# Altium schematic sheet power-systems-v3.SchDoc
size 297 x 209 mm
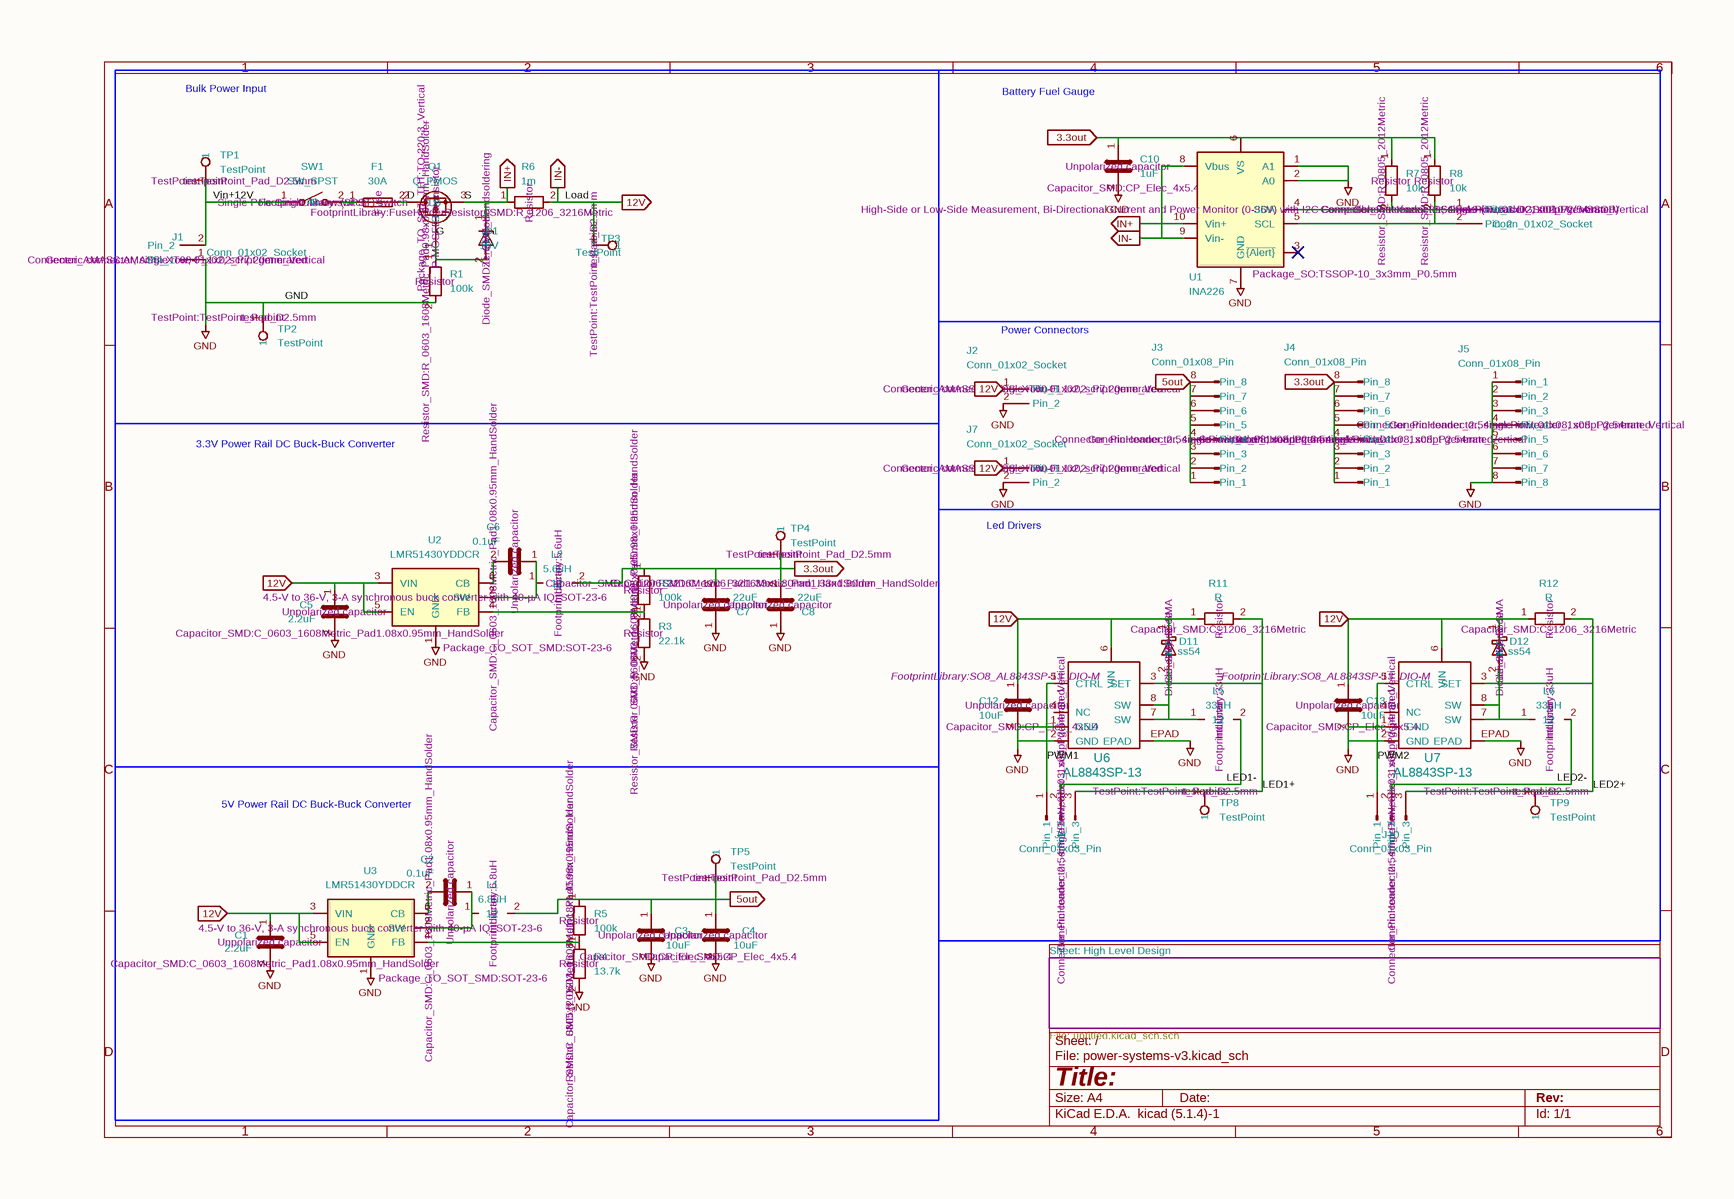
[diagram p0: power-systems-v3.SchDoc]

## Parts
C1  Description: Unpolarized capacitor  Footprint: Capacitor_SMD:C_0603_1608Metric_Pad1.08x0.95mm_HandSolder  [C_0603_1608Metric_Pad1.08x0.95mm_HandSolder]  (hidden comment: 2.2uF)
C2  Description: Unpolarized capacitor  Footprint: Capacitor_SMD:C_0603_1608Metric_Pad1.08x0.95mm_HandSolder  [C_0603_1608Metric_Pad1.08x0.95mm_HandSolder]  (hidden comment: 0.1uF)
C3  Description: Unpolarized capacitor  Footprint: Capacitor_SMD:CP_Elec_4x5.4  [CP_Elec_4x5.4]  (hidden comment: 10uF)
C4  Description: Unpolarized capacitor  Footprint: Capacitor_SMD:CP_Elec_4x5.4  [CP_Elec_4x5.4]  (hidden comment: 10uF)
C5  Description: Unpolarized capacitor  Footprint: Capacitor_SMD:C_0603_1608Metric_Pad1.08x0.95mm_HandSolder  [C_0603_1608Metric_Pad1.08x0.95mm_HandSolder]  (hidden comment: 2.2uF)
C6  Description: Unpolarized capacitor  Footprint: Capacitor_SMD:C_0603_1608Metric_Pad1.08x0.95mm_HandSolder  [C_0603_1608Metric_Pad1.08x0.95mm_HandSolder]  (hidden comment: 0.1uF)
C7  Description: Unpolarized capacitor  Footprint: Capacitor_SMD:C_1206_3216Metric_Pad1.33x1.80mm_HandSolder  [C_1206_3216Metric_Pad1.33x1.80mm_HandSolder]  (hidden comment: 22uF)
C8  Description: Unpolarized capacitor  Footprint: Capacitor_SMD:C_1206_3216Metric_Pad1.33x1.80mm_HandSolder  [C_1206_3216Metric_Pad1.33x1.80mm_HandSolder]  (hidden comment: 22uF)
C10  Description: Unpolarized capacitor  Footprint: Capacitor_SMD:CP_Elec_4x5.4  [CP_Elec_4x5.4]  (hidden comment: 1uF)
C12  Description: Unpolarized capacitor  Footprint: Capacitor_SMD:CP_Elec_4x5.4  [CP_Elec_4x5.4]  (hidden comment: 10uF)
C13  Description: Unpolarized capacitor  Footprint: Capacitor_SMD:CP_Elec_4x5.4  [CP_Elec_4x5.4]  (hidden comment: 10uF)
D1  Description: Zener diode  Footprint: Diode_SMD:D_SMB_Handsoldering  [D_SMB_Handsoldering]  (hidden comment: 10V)
D11  Description: Schottky diode  Footprint: Diode_SMD:D_SMA  [D_SMA]  (hidden comment: ss54)
D12  Description: Schottky diode  Footprint: Diode_SMD:D_SMA  [D_SMA]  (hidden comment: ss54)
F1  Footprint: FootprintLibrary:FuseHolder  [FuseHolder]  (hidden comment: 30A)
J1  Description: Generic connector, single row, 01x02, script generated  Footprint: Connector_AMASS:AMASS_XT60-F_1x02_P7.20mm_Vertical  [AMASS_XT60-F_1x02_P7.20mm_Vertical]  (hidden comment: Conn_01x02_Socket)
J2  Description: Generic connector, single row, 01x02, script generated  Footprint: Connector_AMASS:AMASS_XT60-F_1x02_P7.20mm_Vertical  [AMASS_XT60-F_1x02_P7.20mm_Vertical]  (hidden comment: Conn_01x02_Socket)
J3  Description: Generic connector, single row, 01x08, script generated  Footprint: Connector_PinHeader_2.54mm:PinHeader_1x08_P2.54mm_Vertical  [PinHeader_1x08_P2.54mm_Vertical]  (hidden comment: Conn_01x08_Pin)
J4  Description: Generic connector, single row, 01x08, script generated  Footprint: Connector_PinHeader_2.54mm:PinHeader_1x08_P2.54mm_Vertical  [PinHeader_1x08_P2.54mm_Vertical]  (hidden comment: Conn_01x08_Pin)
J5  Description: Generic connector, single row, 01x08, script generated  Footprint: Connector_PinHeader_2.54mm:PinHeader_1x08_P2.54mm_Vertical  [PinHeader_1x08_P2.54mm_Vertical]  (hidden comment: Conn_01x08_Pin)
J6  Description: Generic connector, single row, 01x02, script generated  Footprint: Connector_PinHeader_2.54mm:PinHeader_1x02_P2.54mm_Vertical  [PinHeader_1x02_P2.54mm_Vertical]  (hidden comment: Conn_01x02_Socket)
J7  Description: Generic connector, single row, 01x02, script generated  Footprint: Connector_AMASS:AMASS_XT60-F_1x02_P7.20mm_Vertical  [AMASS_XT60-F_1x02_P7.20mm_Vertical]  (hidden comment: Conn_01x02_Socket)
J9  Description: Generic connector, single row, 01x03, script generated  Footprint: Connector_PinHeader_2.54mm:PinHeader_1x03_P2.54mm_Vertical  [PinHeader_1x03_P2.54mm_Vertical]  (hidden comment: Conn_01x03_Pin)
J10  Description: Generic connector, single row, 01x03, script generated  Footprint: Connector_PinHeader_2.54mm:PinHeader_1x03_P2.54mm_Vertical  [PinHeader_1x03_P2.54mm_Vertical]  (hidden comment: Conn_01x03_Pin)
L1  Description: Inductor  Footprint: FootprintLibrary:6.8uH  [6.8uH]  (hidden comment: 6.8uH)
L2  Description: Inductor  Footprint: FootprintLibrary:5.6uH  [5.6uH]  (hidden comment: 5.6uH)
L5  Description: Inductor  Footprint: FootprintLibrary:33uH  [33uH]  (hidden comment: 33uH)
L6  Description: Inductor  Footprint: FootprintLibrary:33uH  [33uH]  (hidden comment: 33uH)
Q1  Description: P-MOSFET transistor  Footprint: Package_TO_SOT_THT:TO-220-3_Vertical  [TO-220-3_Vertical]  (hidden comment: Q_PMOS)
R1  Description: Resistor  Footprint: Resistor_SMD:R_0603_1608Metric_Pad0.98x0.95mm_HandSolder  [R_0603_1608Metric_Pad0.98x0.95mm_HandSolder]  (hidden comment: 100k)
R2  Description: Resistor  Footprint: Resistor_SMD:R_0603_1608Metric_Pad0.98x0.95mm_HandSolder  [R_0603_1608Metric_Pad0.98x0.95mm_HandSolder]  (hidden comment: 100k)
R3  Description: Resistor  Footprint: Resistor_SMD:R_0603_1608Metric_Pad0.98x0.95mm_HandSolder  [R_0603_1608Metric_Pad0.98x0.95mm_HandSolder]  (hidden comment: 22.1k)
R4  Description: Resistor  Footprint: Capacitor_SMD:C_0805_2012Metric_Pad1.18x1.45mm_HandSolder  [C_0805_2012Metric_Pad1.18x1.45mm_HandSolder]  (hidden comment: 13.7k)
R5  Description: Resistor  Footprint: Resistor_SMD:R_0603_1608Metric_Pad0.98x0.95mm_HandSolder  [R_0603_1608Metric_Pad0.98x0.95mm_HandSolder]  (hidden comment: 100k)
R6  Description: Resistor  Footprint: Resistor_SMD:R_1206_3216Metric  [R_1206_3216Metric]  (hidden comment: 1m)
R7  Description: Resistor  Footprint: Resistor_SMD:R_0805_2012Metric  [R_0805_2012Metric]  (hidden comment: 10k)
R8  Description: Resistor  Footprint: Resistor_SMD:R_0805_2012Metric  [R_0805_2012Metric]  (hidden comment: 10k)
R11  Description: Resistor  Footprint: Capacitor_SMD:C_1206_3216Metric  [C_1206_3216Metric]  (hidden comment: R)
R12  Description: Resistor  Footprint: Capacitor_SMD:C_1206_3216Metric  [C_1206_3216Metric]  (hidden comment: R)
SW1  Description: Single Pole Single Throw (SPST) switch  Footprint: FootprintLibrary:switch  [switch]  (hidden comment: SW_SPST)
TP1  Description: test point  Footprint: TestPoint:TestPoint_Pad_D2.5mm  [TestPoint_Pad_D2.5mm]  (hidden comment: TestPoint)
TP2  Description: test point  Footprint: TestPoint:TestPoint_Pad_D2.5mm  [TestPoint_Pad_D2.5mm]  (hidden comment: TestPoint)
TP3  Description: test point  Footprint: TestPoint:TestPoint_Pad_D2.5mm  [TestPoint_Pad_D2.5mm]  (hidden comment: TestPoint)
TP4  Description: test point  Footprint: TestPoint:TestPoint_Pad_D2.5mm  [TestPoint_Pad_D2.5mm]  (hidden comment: TestPoint)
TP5  Description: test point  Footprint: TestPoint:TestPoint_Pad_D2.5mm  [TestPoint_Pad_D2.5mm]  (hidden comment: TestPoint)
TP8  Description: test point  Footprint: TestPoint:TestPoint_Pad_D2.5mm  [TestPoint_Pad_D2.5mm]  (hidden comment: TestPoint)
TP9  Description: test point  Footprint: TestPoint:TestPoint_Pad_D2.5mm  [TestPoint_Pad_D2.5mm]  (hidden comment: TestPoint)
U1  Description: High-Side or Low-Side Measurement, Bi-Directional Current and Power Monitor (0-36V) with I2C Compatible Interface, TSSOP-10 (Texas DGS0010A / VSSOP)  Footprint: Package_SO:TSSOP-10_3x3mm_P0.5mm  [TSSOP-10_3x3mm_P0.5mm]  (hidden comment: INA226)
U2  Description: 4.5-V to 36-V, 3-A synchronous buck converter with 40-µA IQ, SOT-23-6  Footprint: Package_TO_SOT_SMD:SOT-23-6  [SOT-23-6]  (hidden comment: LMR51430YDDCR)
U3  Description: 4.5-V to 36-V, 3-A synchronous buck converter with 40-µA IQ, SOT-23-6  Footprint: Package_TO_SOT_SMD:SOT-23-6  [SOT-23-6]  (hidden comment: LMR51430YDDCR)
U6  Footprint: FootprintLibrary:SO8_AL8843SP-13_DIO-M  [SO8_AL8843SP-13_DIO-M]  (hidden comment: AL8843SP-13)
U7  Footprint: FootprintLibrary:SO8_AL8843SP-13_DIO-M  [SO8_AL8843SP-13_DIO-M]  (hidden comment: AL8843SP-13)

## Blocks framed on the sheet
Bulk Power Input /: D1 F1 J1 Q1 R1 R6 SW1 TP1-TP3
Battery Fuel Gauge /: C10 J6 R7 R8 U1
Power Connectors: J2-J5 J7
3.3V Power Rail / DC Buck-Buck Converter: C5-C8 L2 R2 R3 TP4 U2
Led Drivers /: C12 C13 D11 D12 J9 J10 L5 L6 R11 R12 TP8 TP9 U6 U7
5V Power Rail / DC Buck-Buck Converter: C1-C4 L1 R4 R5 TP5 U3

## Sub-sheets
High Level Design = untitled.SchDoc: no entries

## Ports
3.3out (in), 3.3out (out), 5out (in), 5out (out), 12V (in), 12V (out), IN+ (out), IN- (out)

## Nets
GND: C1.2 C3.2 C4.2 C5.2 C7.1 C8.1 C10.2 C12.2 C13.2 J1.1(Pin_1) J2.2(Pin_2) J5.1(Pin_1) J5.2(Pin_2) J5.3(Pin_3) J5.4(Pin_4) J5.5(Pin_5) J5.6(Pin_6) J5.7(Pin_7) J5.8(Pin_8) J7.2(Pin_2) R1.2 R3.2 R4.2 TP2.1 U1.1(A1) U1.2(A0) U1.7(GND) U2.1(GND) U3.1(GND) U6.1(GND) U6.2(GND) U6.EPAD U7.1(GND) U7.2(GND) U7.EPAD
3.3out: C7.2 C8.2 C10.1 J4.1(Pin_1) J4.2(Pin_2) J4.3(Pin_3) J4.4(Pin_4) J4.5(Pin_5) J4.6(Pin_6) J4.7(Pin_7) J4.8(Pin_8) L2.2 R2.1 R7.1 R8.1 TP4.1 U1.6(VS) ; port 3.3out
5out: C3.1 C4.1 J3.1(Pin_1) J3.2(Pin_2) J3.3(Pin_3) J3.4(Pin_4) J3.5(Pin_5) J3.6(Pin_6) J3.7(Pin_7) J3.8(Pin_8) L1.2 R5.1 TP5.1 ; port 5out
D: F1.2 Q1.2(D)
LED1+: J9.3(Pin_3) R11.2 TP8.1 U6.3(SET)
LED1-: J9.2(Pin_2) L5.2
LED2+: J10.3(Pin_3) R12.2 TP9.1 U7.3(SET)
LED2-: J10.2(Pin_2) L6.2
Load: C1.1 C5.1 C12.1 C13.1 D11.1(K) D12.1(K) J2.1(Pin_1) J7.1(Pin_1) R6.2 R11.1 R12.1 TP3.1 U1.8(Vbus) U1.9(Vin-) U2.3(VIN) U2.5(EN) U3.3(VIN) U3.5(EN) U6.6(VIN) U7.6(VIN) ; port 12V, port IN-
PWM1: J9.1(Pin_1) U6.5(CTRL)
PWM2: J10.1(Pin_1) U7.5(CTRL)
S: D1.1(K) Q1.3(S) R6.1 U1.10(Vin+) ; port IN+
Vin+12V: J1.2(Pin_2) SW1.1(A) TP1.1
NetC2_1: C2.1 L1.1 U3.2(SW)
NetC2_2: C2.2 U3.6(CB)
NetC6_1: C6.1 L2.1 U2.2(SW)
NetC6_2: C6.2 U2.6(CB)
NetD1_2: D1.2(A) Q1.1(G) R1.1
NetD11_2: D11.2(A) L5.1 U6.7(SW) U6.8(SW)
NetD12_2: D12.2(A) L6.1 U7.7(SW) U7.8(SW)
NetF1_1: F1.1 SW1.2(B)
NetJ6_1: J6.1(Pin_1) R7.2 U1.4(SDA)
NetJ6_2: J6.2(Pin_2) R8.2 U1.5(SCL)
NetR2_2: R2.2 R3.1 U2.4(FB)
NetR4_1: R4.1 R5.2 U3.4(FB)

Not connected (* = marked no-connect by the designer): U1 3(~{{Alert}})*; U6 4(NC); U7 4(NC)

## Notes on the sheet
- Sheet: High Level Design
- File: untitled.kicad_sch.sch
- Labels drawn without touching a wire or pin: G
- 1
- 2
- 3
- 4
- 5
- 6
- A
- B
- C
- D
- Title:
- File: power-systems-v3.kicad_sch
- Sheet: /
- KiCad E.D.A.  kicad (5.1.4)-1
- Size: A4
- Date:
- Rev:
- Id: 1/1

## Library data of the parts
C1-C8 C10 C12 C13 = C
  C1 C5: Value: 2.2uF
  C2 C6: Value: 0.1uF
  C3 C4 C12 C13: Value: 10uF
  C7 C8: Value: 22uF
  C10: Value: 1uF
D1 = D_Zener: Value: 10V
D11 D12 = D_Schottky: Value: ss54
F1 = Fuse: Description: Fuse; Value: 30A
L1 L2 L5 L6 = L
  L1: Value: 6.8uH
  L2: Value: 5.6uH
  L5 L6: Value: 33uH
R1-R8 = R
  R1 R2 R5: Value: 100k
  R3: Value: 22.1k
  R4: Value: 13.7k
  R6: Value: 1m
  R7 R8: Value: 10k
U2 U3 = LMR51430: Value: LMR51430YDDCR
U6 U7 = AL8843SP-13_1: Value: AL8843SP-13
J1 J2 J6 J7 = Conn_01x02_Socket: Value: Conn_01x02_Socket
J3-J5 = Conn_01x08_Pin: Value: Conn_01x08_Pin
J9 J10 = Conn_01x03_Pin: Value: Conn_01x03_Pin
Q1 = Q_PMOS: Value: Q_PMOS
R11 R12 = R: Value: R
SW1 = SW_SPST: Value: SW_SPST
TP1-TP5 TP8 TP9 = TestPoint: Value: TestPoint
U1 = INA226: Value: INA226